# Altium schematic sheet USB-NORA-W1_SCHEM_03.SchDoc
size B; Date: 7/24/2020; CompanyName: U-blox; DrawnBy: EMOO; Engineer: EMOO; Organization: U-blox; Address1: 3950 Fairview Industrial Dr SE #100; Address2: Salem, OR 97302; DocumentNumber: 3; SheetNumber: 3; SheetTotal: 3; SheetSize: B; SheetTitle: Connectors
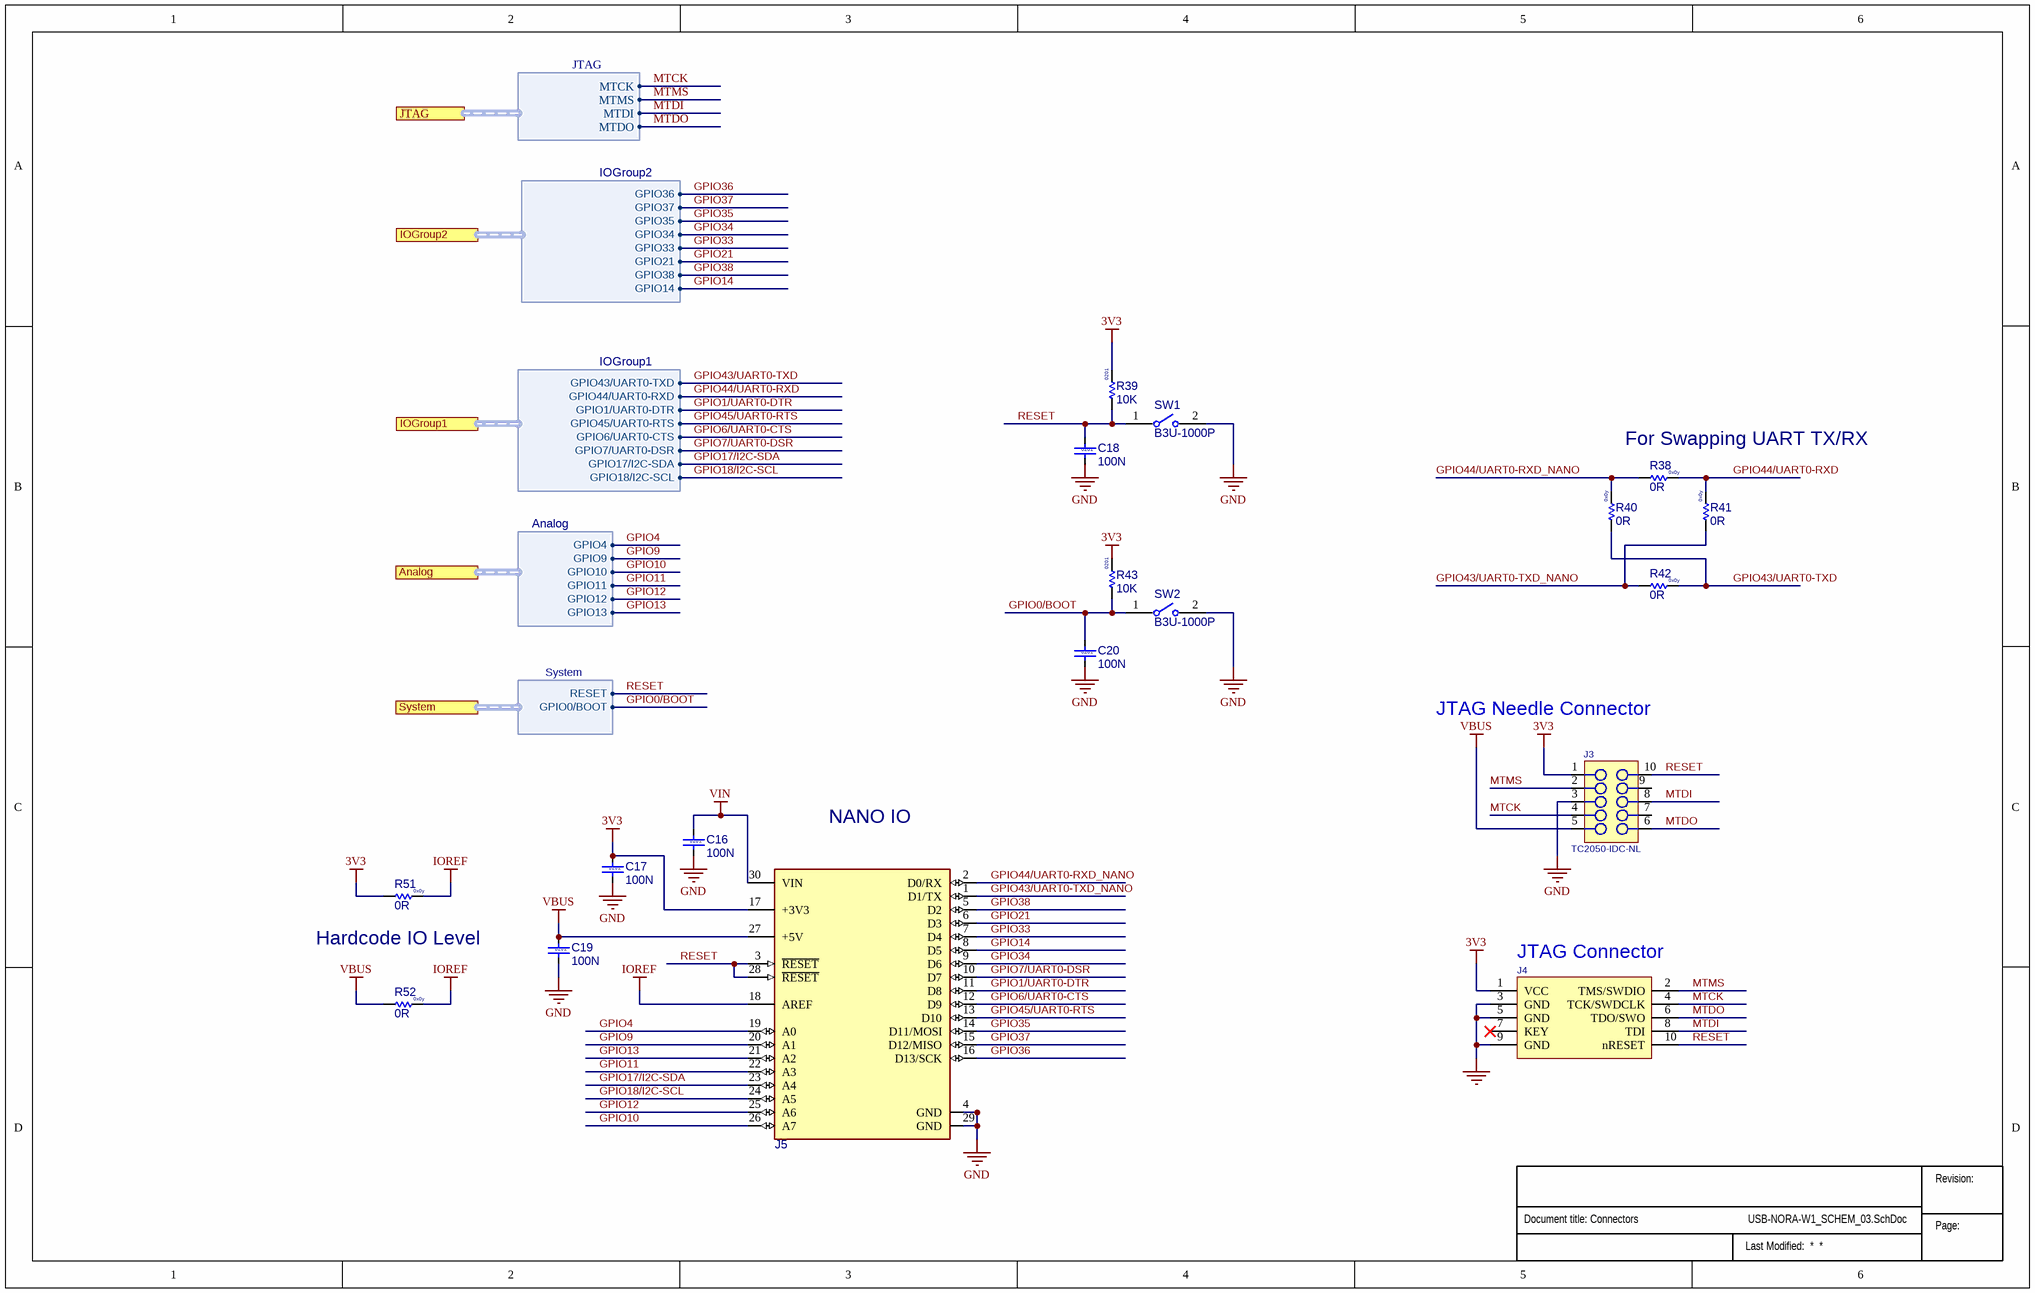
[diagram p0: USB-NORA-W1_SCHEM_03.SchDoc]

## Parts
?  (no value)  (graphical)
C16  value 100N  Size: 0201  [Cap 0201 HD]  (hidden comment: UBXH01-0000417100N)
C17  value 100N  Size: 0201  [Cap 0201 HD]  (hidden comment: UBXH01-0000417100N)
C18  value 100N  Size: 0201  [Cap 0201 HD]  (hidden comment: UBXH01-0000417100N)
C19  value 100N  Size: 0201  [Cap 0201 HD]  (hidden comment: UBXH01-0000417100N)
C20  value 100N  Size: 0201  [Cap 0201 HD]  (hidden comment: UBXH01-0000417100N)
J3  TC2050-IDC-NLDNP  [TC2050-IDC-NL]  (value not drawn)  (no BOM)
J4  130-00099  [HDR.050P-10Pin-2x5-SMT_Key]  (value not drawn)
J5  UNK_Arduino  [UNK_Arduino]  (value not drawn)
R38  value 0R  Size: 0x0y  [RES 0402 HD]
R39  value 10K  Size: 0201  [RES 0201 HD]
R40  value 0R  Size: 0x0y  [RES 0402 HD]
R41  value 0R  Size: 0x0y  [RES 0402 HD]
R42  value 0R  Size: 0x0y  [RES 0402 HD]
R43  value 10K  Size: 0201  [RES 0201 HD]  (hidden comment: UBXH18-000807310K)
R51  value 0R  Size: 0x0y  [RES 0402 HD]
R52  value 0R  Size: 0x0y  [RES 0402 HD]
SW1  B3U-1000P  [FP-B3U-1000P-MFG]
SW2  B3U-1000P  [FP-B3U-1000P-MFG]

## Ports
Analog (harness Analog, see USB-NORA-W1_TOP_01[4B], USB-NORA-W1_SCHEM_02[1D]), IOGroup1 (harness IOGroup1, see USB-NORA-W1_TOP_01[4B], USB-NORA-W1_SCHEM_02[1C]), IOGroup2 (harness IOGroup2, see USB-NORA-W1_TOP_01[4B], USB-NORA-W1_SCHEM_02[1D]), JTAG (harness JTAG, see USB-NORA-W1_TOP_01[4B], USB-NORA-W1_SCHEM_02[3D]), System (harness System, see USB-NORA-W1_TOP_01[4B], USB-NORA-W1_SCHEM_02[1C])

## Harnesses
IOGroup2: GPIO36, GPIO37, GPIO35, GPIO34, GPIO33, GPIO21, GPIO38, GPIO14
IOGroup1: GPIO43/UART0-TXD, GPIO44/UART0-RXD, GPIO1/UART0-DTR, GPIO45/UART0-RTS, GPIO6/UART0-CTS, GPIO7/UART0-DSR, GPIO17/I2C-SDA, GPIO18/I2C-SCL
System: RESET, GPIO0/BOOT
Analog: GPIO4, GPIO9, GPIO10, GPIO11, GPIO12, GPIO13
JTAG: MTCK, MTMS, MTDI, MTDO

## Nets
3V3: C17.1 J3.1 J4.1(VCC) J5.17(+3V3) R39.2 R43.2 R51.1
GND: C16.2 C17.2 C18.2 C19.2 C20.2 J3.3 J4.3(GND) J4.5(GND) J4.9(GND) J5.4(GND) J5.29(GND) SW1.2 SW2.2
IOREF: J5.18(AREF) R51.2 R52.2
VBUS: C19.1 J3.5 J5.27(+5V) R52.1
VIN: C16.1 J5.30(VIN)
GPIO0/BOOT: C20.1 R43.1 SW2.1 ; port System.GPIO0/BOOT
GPIO1/UART0-DTR: J5.11(D8) ; port IOGroup1.GPIO1/UART0-DTR
GPIO4: J5.19(A0) ; port Analog.GPIO4
GPIO6/UART0-CTS: J5.12(D9) ; port IOGroup1.GPIO6/UART0-CTS
GPIO7/UART0-DSR: J5.10(D7) ; port IOGroup1.GPIO7/UART0-DSR
GPIO9: J5.20(A1) ; port Analog.GPIO9
GPIO10: J5.26(A7) ; port Analog.GPIO10
GPIO11: J5.22(A3) ; port Analog.GPIO11
GPIO12: J5.25(A6) ; port Analog.GPIO12
GPIO13: J5.21(A2) ; port Analog.GPIO13
GPIO14: J5.8(D5) ; port IOGroup2.GPIO14
GPIO17/I2C-SDA: J5.23(A4) ; port IOGroup1.GPIO17/I2C-SDA
GPIO18/I2C-SCL: J5.24(A5) ; port IOGroup1.GPIO18/I2C-SCL
GPIO21: J5.6(D3) ; port IOGroup2.GPIO21
GPIO33: J5.7(D4) ; port IOGroup2.GPIO33
GPIO34: J5.9(D6) ; port IOGroup2.GPIO34
GPIO35: J5.14(D11/MOSI) ; port IOGroup2.GPIO35
GPIO36: J5.16(D13/SCK) ; port IOGroup2.GPIO36
GPIO37: J5.15(D12/MISO) ; port IOGroup2.GPIO37
GPIO38: J5.5(D2) ; port IOGroup2.GPIO38
GPIO43/UART0-TXD: R40.1 R42.2 ; port IOGroup1.GPIO43/UART0-TXD
GPIO43/UART0-TXD_NANO: J5.1(D1/TX) R41.1 R42.1
GPIO44/UART0-RXD: R38.2 R41.2 ; port IOGroup1.GPIO44/UART0-RXD
GPIO44/UART0-RXD_NANO: J5.2(D0/RX) R38.1 R40.2
GPIO45/UART0-RTS: J5.13(D10) ; port IOGroup1.GPIO45/UART0-RTS
MTCK: J3.4 J4.4(TCK/SWDCLK) ; port JTAG.MTCK
MTDI: J3.8 J4.8(TDI) ; port JTAG.MTDI
MTDO: J3.6 J4.6(TDO/SWO) ; port JTAG.MTDO
MTMS: J3.2 J4.2(TMS/SWDIO) ; port JTAG.MTMS
RESET: C18.1 J3.10 J4.10(nRESET) J5.3(~{RESET}) J5.28(~{RESET}) R39.1 SW1.1 ; port System.RESET

Not connected (* = marked no-connect by the designer): J3 7 9; J4 7(KEY)*

## Notes on the sheet
- (near R38) For Swapping UART TX/RX
- JTAG Needle Connector
- NANO IO
- (near R51) Hardcode IO Level
- (near J4) JTAG Connector
- Revision:
- Page:

## Library data of the parts
? = Sub_Title_Block: Minimized schematic title block for all subset sheets
C16-C20 = UBXH01-0000245: CAP CER X5R 0201 100N 10% 10V; Manufacturer: Murata Manufacturing Company, Ltd.; Manufacturer P/N: GRM033R61A104KE84; Editor: dario.antonaz; Released by: jure.podmenik; Env: ROHS; Permitted Use: Volume Products; Perferred: PREF; Mfg P/N Status: Active; Mfg P/N Split: 0; Mfg P/N Released: Yes; Part Number: UBXH01-0000245; Tolerance: 10%; Max Voltage: 10V; Min Operating Temp: -40°C; Max Operating Temp: 85°C; Part Type: Capacitor; Release Data: 2016-03-11 16:09:03.879257; UBX Wiki: https://wiki.u-blox.com/bin/view/Operations/PartDetails?index=24347; RefDes: C; Mfg P/N Datasheet: https://wiki.u-blox.com/bin/view/Generic/Docs/DocumentSummary?index=24348; Manufacturer 2: Taiyo Yuden Company, Ltd.; Manufacturer P/N 2: LMK063BJ104KP-F; Mfg P/N Status 2: Active; Mfg P/N Split 2: 0; Mfg P/N Released 2: Yes; Mfg P/N Datasheet 2: https://wiki.u-blox.com/bin/view/Generic/Docs/DocumentSummary?index=27440; Manufacturer 3: Samsung Electro-Mechanics; Manufacturer P/N 3: CL03A104KA3NNN; Mfg P/N Status 3: Active; Mfg P/N Split 3: 0; Mfg P/N Released 3: Yes; Mfg P/N Datasheet 3: https://wiki.u-blox.com/bin/view/Generic/Docs/DocumentSummary?index=28183
J3 = TC2050-IDC-NL: CON PADS FOR CBL PLUG-OF-NAILS 10-PIN NO LEGS; Manufacturer: TAG Connect; Added By: Paul B; Manufacturer P/N: TC2050-IDC-NL; Part Number: TC2050-IDC-NL; Size: 6.1mm x 9.9mm; Height: 0; DNP: DNP; Added Date: 12/3/2015
J4 = 130-00099: Header 0.05" 10Pin 2Row SMD Black; Part Name: CON HDR 0.05" 10Pin 2Row SMD Black; Part_Type: Connector; Manufacturer: Samtec; Manufacturer P/N: FTSH-105-01-F-DV-K; Item_Phase: Pre-Production; Component Mounting Type: SMT; Keyed: Yes; Locking: No; Pin Pitch: 0.050"; Rows: 2; Part Number: 130-00099; Revision: 1; Supplier 1: Digi-Key; Supplier Part Number 1: SAM8796-ND; Arena Link: https://app.bom.com/a/5N6EKRARATS7TSHL?v=spec.summary; Color: Black; Connector Type: Header; Height: 6mm; Length: 12.75mm; Pins: 10; Use in new designs: Yes; Width: 4.78
J5 = UBXH04-0000717: ARDUINO NANO 33 IOT CONN; Editor: aneeb.sohail; Env: ROHS; Permitted Use: Support Products; Perferred: PREF; Part Number: UBXH04-0000717; Min Operating Temp: -40°C; Max Operating Temp: 85°C; Part Type: Connector; UBX Wiki: https://wiki.u-blox.com/bin/view/Operations/PartDetails?index=35490; RefDes: J
R38 R40-R42 R51 R52 = UBXH18-0003002: RES THICK FILM CHIP 0402; Manufacturer: YAGEO; Manufacturer P/N: 2322_705_91001_L; Tolerance: 0; Max Power: 100mW; Editor: charlotte.biber; Released by: peter.mueller; Env: ROHS; Permitted Use: Volume Products; Perferred: PREF; Mfg P/N Status: NRND; Mfg P/N Released: Yes; Part Number: UBXH18-0003002; Part Type: Resistor; Release Data: 2012-06-05 09:49:55.978616; UBX Wiki: https://wiki.u-blox.com/bin/view/Operations/PartDetails?index=6611; RefDes: R; Mfg P/N Split: 0
R39 R43 = UBXH18-0001097: RES THICK FILM CHIP 0201 10K 5% 50mW; Manufacturer: KOA; Manufacturer P/N: RK73B1HTTC103J; Editor: martin.pilik; Released by: fabrice.bret-dibat; Env: GREEN; Permitted Use: Volume Products; Perferred: PREF; Mfg P/N Status: Active; Mfg P/N Split: 100; Mfg P/N Released: Yes; Part Number: UBXH18-0001097; Tolerance: 5%; Max Power: 50mW; Part Type: Resistor; Release Data: 2021-05-21 12:17:49.148436; UBX Wiki: https://wiki.u-blox.com/bin/view/Operations/PartDetails?index=6581; RefDes: R; Mfg P/N Datasheet: https://wiki.u-blox.com/bin/view/Generic/Docs/DocumentSummary?index=4543; Manufacturer 2: Panasonic; Manufacturer P/N 2: ERJ-1GNJ103C; Mfg P/N Status 2: Active; Mfg P/N Split 2: 0; Mfg P/N Released 2: No; Mfg P/N Datasheet 2: https://wiki.u-blox.com/bin/view/Generic/Docs/DocumentSummary?index=35141; Manufacturer 3: YAGEO; Manufacturer P/N 3: RC0201JR-0710KL; Mfg P/N Status 3: Active; Mfg P/N Split 3: 0; Mfg P/N Released 3: Yes; Mfg P/N Datasheet 3: https://wiki.u-blox.com/bin/view/Generic/Docs/DocumentSummary?index=26941
SW1 SW2 = CMP-2100-03586-2: SWITCH TACTILE SPST-NO 0.05A 12V; Contact Resistance: 100mR; Operating Force: 1.5N; Max Current Rating: 50mA; Switch Travel: 0.15mm; Actuator Type: Standard; Mechanical Life: 200000Cycles; Ratings: Dust Proof; Illumination Type: Non-Illuminated; Throw Configuration: SPST; Actuator Length: 0.4mm; Switch Function: Off-Mom; Height: 1.2mm; Width: 3mm; Weight: 0.000776oz; Contact Material: Silver; Max Voltage Rating (DC): 12V; Insulation Resistance: 100MR; Lead Free: Lead Free; Current Rating: 50mA; Termination: SMD/SMT; Length: 4mm; Voltage Rating (DC): 12V; Contact Current Rating: 50mA; Orientation: Straight; Depth: 2.5mm; Max Operating Temperature: 70°C; Packaging: Tape and Reel; Min Operating Temperature: -25°C; Package Quantity: 1; Mount: Surface Mount; Electrical Life: 200000Cycles